# Altium project esp-air-quality-sensor.PrjPcb
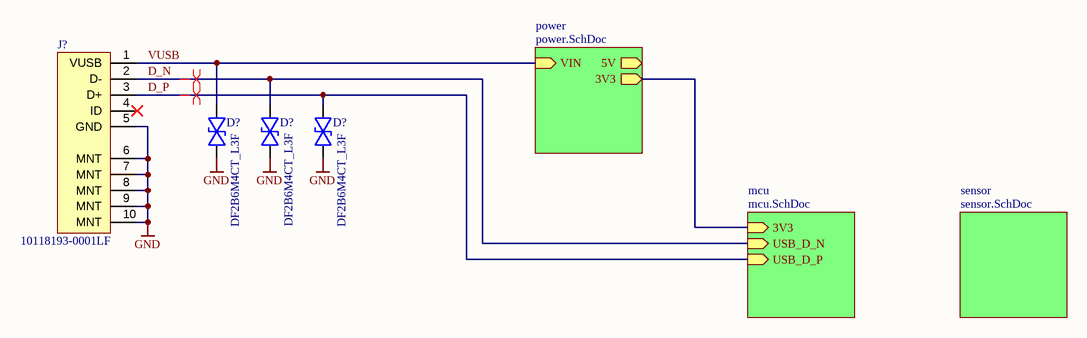
[diagram p0: top.SchDoc]
4 sheets, 59 parts. Net scope: hierarchical (ports join the sheet entries above them; power ports are global).
Board file: board.PcbDoc
Sheets:
  top.SchDoc
    power = power.SchDoc
    mcu = mcu.SchDoc
    sensor = sensor.SchDoc

## Sheet top.SchDoc: schematic template
size 420 x 297 mm; Date: 2021-12-08; Author: Joachim Löfwander; Revision: ABC-123; SheetNumber: 1; SheetTotal: 4; Website: jlofw.com

### Parts
(Parts that share a designator on the sheet are numbered #1, #2 ... from top to bottom, then left to right.)
D?#1  Manufacturer P/N: DF2B6M4CT_L3F  [D_SOD-882]  (hidden comment: Diode_TVS_Bi)
D?#2  Manufacturer P/N: DF2B6M4CT_L3F  [D_SOD-882]  (hidden comment: Diode_TVS_Bi)
D?#3  Manufacturer P/N: DF2B6M4CT_L3F  [D_SOD-882]  (hidden comment: Diode_TVS_Bi)
J?#1  Manufacturer P/N: 10118193-0001LF  [Amphenol_10118193-0001LF_Micro_USB]  (hidden comment: Amphenol_10118193-0001LF_Micro_USB)

### Sub-sheets
mcu = mcu.SchDoc: 3V3 (in), USB_D_P (in), USB_D_N (in)
power = power.SchDoc: VIN (in), 3V3 (out), 5V (out)
sensor = sensor.SchDoc: no entries

### Nets
GND: D?#1.2(A) D?#2.2(A) D?#3.2(A) J?#1.5(GND) J?#1.6(MNT) J?#1.7(MNT) J?#1.8(MNT) J?#1.9(MNT) J?#1.10(MNT)
3V3: sheet power/3V3, sheet mcu/3V3
D_N: D?#2.1(C) J?#1.2(D-) ; sheet mcu/USB_D_N
D_P: D?#3.1(C) J?#1.3(D+) ; sheet mcu/USB_D_P
VUSB: D?#1.1(C) J?#1.1(VUSB) ; sheet power/VIN

Not connected (* = marked no-connect by the designer): J?#1 4(ID)*

### Layout directives
differential pair: D_N, D_P

### Notes on the sheet
- PROJECT
- TITLE
- FILE NAME
- DATE MODIFIED
- SHEET
- REV
- OF
- AUTHOR
- WEBSITE

### Library data of the parts
D?#1-D?#3 = 40005: TVS DIODE 5.5VWM 15VC; Manufacturer: Toshiba; Internal Number: 40005; Package: SOD-882
J?#1 = 110003: Micro USB B SMD Horisontal; Manufacturer: Amphenol ICC / FCI; Internal Number: 110003

## Sheet power.SchDoc: schematic template
size 420 x 297 mm; Date: 2021-12-08; Author: Joachim Löfwander; Revision: ABC-123; SheetNumber: 2; SheetTotal: 4; Website: jlofw.com
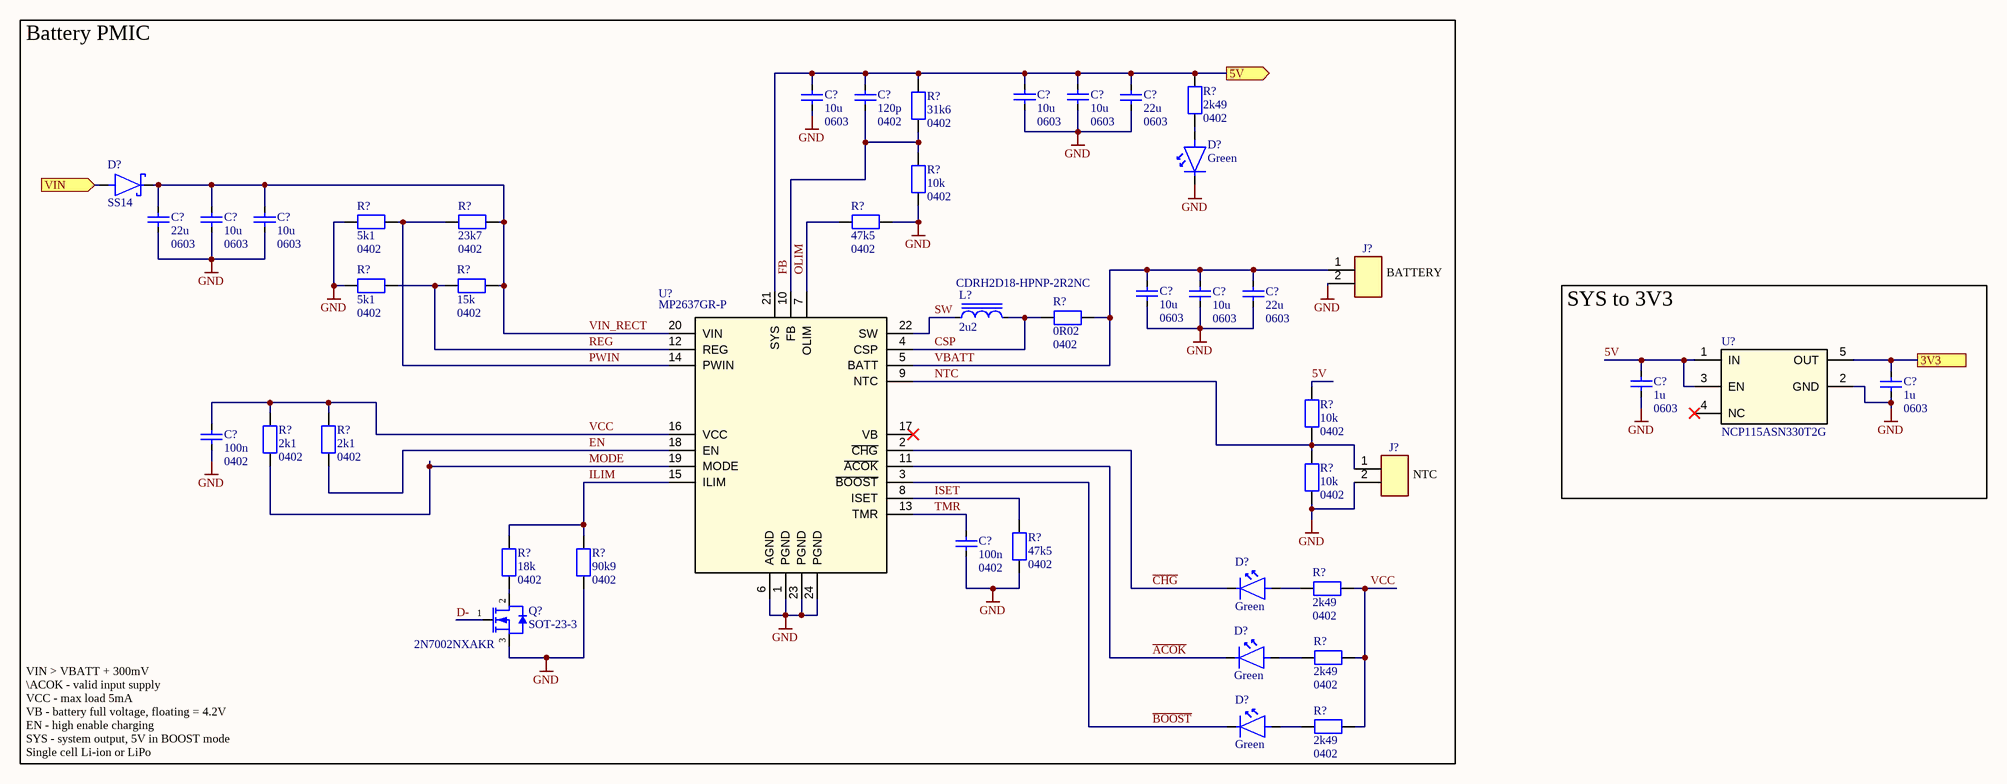
[diagram p1: power.SchDoc]

### Parts
(Parts that share a designator on the sheet are numbered #1, #2 ... from top to bottom, then left to right.)
C?#1  value 10u  Package: 0603  [C_0603_1608Metric_IPCB]  (hidden comment: Capacitor_Ceramic)
C?#2  value 120p  Package: 0402  [C_0402_1005Metric_IPCB]  (hidden comment: Capacitor_Ceramic)
C?#3  value 10u  Package: 0603  [C_0603_1608Metric_IPCB]  (hidden comment: Capacitor_Ceramic)
C?#4  value 10u  Package: 0603  [C_0603_1608Metric_IPCB]  (hidden comment: Capacitor_Ceramic)
C?#5  value 22u  Package: 0603  [C_0603_1608Metric_IPCB]  (hidden comment: Capacitor_Ceramic)
C?#6  value 22u  Package: 0603  [C_0603_1608Metric_IPCB]  (hidden comment: Capacitor_Ceramic)
C?#7  value 10u  Package: 0603  [C_0603_1608Metric_IPCB]  (hidden comment: Capacitor_Ceramic)
C?#8  value 10u  Package: 0603  [C_0603_1608Metric_IPCB]  (hidden comment: Capacitor_Ceramic)
C?#9  value 10u  Package: 0603  [C_0603_1608Metric_IPCB]  (hidden comment: Capacitor_Ceramic)
C?#10  value 10u  Package: 0603  [C_0603_1608Metric_IPCB]  (hidden comment: Capacitor_Ceramic)
C?#11  value 22u  Package: 0603  [C_0603_1608Metric_IPCB]  (hidden comment: Capacitor_Ceramic)
C?#12  value 1u  Package: 0603  [C_0603_1608Metric_IPCB]  (hidden comment: Capacitor_Ceramic)
C?#13  value 1u  Package: 0603  [C_0603_1608Metric_IPCB]  (hidden comment: Capacitor_Ceramic)
C?#14  value 100n  Package: 0402  [C_0402_1005Metric_IPCB]  (hidden comment: Capacitor_Ceramic)
C?#15  value 100n  Package: 0402  [C_0402_1005Metric_IPCB]  (hidden comment: Capacitor_Ceramic)
D?#4  value Green  [LED_0402]  (hidden comment: Diode_LED)
D?#5  Manufacturer P/N: SS14  [D_SMA_IPCB]  (hidden comment: Diode_Schottky)
D?#6  value Green  [LED_0402]  (hidden comment: Diode_LED)
D?#7  value Green  [LED_0402]  (hidden comment: Diode_LED)
D?#8  value Green  [LED_0402]  (hidden comment: Diode_LED)
J?#2  Conn_01x02  [PinHeader_1x02_P2.54mm_Vertical]  (value not drawn)
J?#3  Conn_01x02  [PinHeader_1x02_P2.54mm_Vertical]  (value not drawn)
L?  value 2u2  Manufacturer P/N: CDRH2D18-HPNP-2R2NC  [Sumida_CDRH2D18-HPNP-2R2NC]  (hidden comment: Inductor)
Q?#1  Package: SOT-23-3  Manufacturer P/N: 2N7002NXAKR  [SOT23-3_Standard_IPCB]  (hidden comment: NMOS_GDS)
R?#1  value 2k49  Package: 0402  [R_0402_1005Metric_IPCB]  (hidden comment: Resistor)
R?#2  value 31k6  Package: 0402  [R_0402_1005Metric_IPCB]  (hidden comment: Resistor)
R?#3  value 10k  Package: 0402  [R_0402_1005Metric_IPCB]  (hidden comment: Resistor)
R?#4  value 5k1  Package: 0402  [R_0402_1005Metric_IPCB]  (hidden comment: Resistor)
R?#5  value 23k7  Package: 0402  [R_0402_1005Metric_IPCB]  (hidden comment: Resistor)
R?#6  value 47k5  Package: 0402  [R_0402_1005Metric_IPCB]  (hidden comment: Resistor)
R?#7  value 5k1  Package: 0402  [R_0402_1005Metric_IPCB]  (hidden comment: Resistor)
R?#8  value 15k  Package: 0402  [R_0402_1005Metric_IPCB]  (hidden comment: Resistor)
R?#9  value 0R02  Package: 0402  [R_0402_1005Metric_IPCB]  (hidden comment: Resistor)
R?#10  value 10k  Package: 0402  [R_0402_1005Metric_IPCB]  (hidden comment: Resistor)
R?#11  value 2k1  Package: 0402  [R_0402_1005Metric_IPCB]  (hidden comment: Resistor)
R?#12  value 2k1  Package: 0402  [R_0402_1005Metric_IPCB]  (hidden comment: Resistor)
R?#13  value 10k  Package: 0402  [R_0402_1005Metric_IPCB]  (hidden comment: Resistor)
R?#14  value 47k5  Package: 0402  [R_0402_1005Metric_IPCB]  (hidden comment: Resistor)
R?#15  value 18k  Package: 0402  [R_0402_1005Metric_IPCB]  (hidden comment: Resistor)
R?#16  value 90k9  Package: 0402  [R_0402_1005Metric_IPCB]  (hidden comment: Resistor)
R?#17  value 2k49  Package: 0402  [R_0402_1005Metric_IPCB]  (hidden comment: Resistor)
R?#18  value 2k49  Package: 0402  [R_0402_1005Metric_IPCB]  (hidden comment: Resistor)
R?#19  value 2k49  Package: 0402  [R_0402_1005Metric_IPCB]  (hidden comment: Resistor)
U?#1  NCP115ASN330T2G  [NCP115ASN330T2G]
U?#2  Manufacturer P/N: MP2637GR-P  [MP2637GR]  (hidden comment: MP2637GR)

### Blocks framed on the sheet
Battery PMIC: C?#1-C?#11 C?#14 C?#15 D?#4-D?#8 J?#2 J?#3 L? Q?#1 R?#1-R?#19 U?#2
SYS to 3V3: C?#12 C?#13 U?#1

### Ports
3V3, 5V (out), VIN (in)

### Nets
GND: C?#1.1 C?#3.1 C?#4.1 C?#5.1 C?#6.1 C?#7.1 C?#8.1 C?#9.1 C?#10.1 C?#11.1 C?#12.1 C?#13.1 C?#14.1 C?#15.1 D?#4.1(C) J?#2.2 J?#3.2 Q?#1.3(SOURCE) R?#3.1 R?#4.1 R?#6.2 R?#7.1 R?#13.1 R?#14.1 R?#16.1 U?#1.2(GND) U?#2.1(PGND) U?#2.6(AGND) U?#2.23(PGND) U?#2.24(PGND)
3V3: C?#13.2 U?#1.5(OUT) ; port 3V3
5V: C?#1.2 C?#2.2 C?#3.2 C?#4.2 C?#5.2 R?#1.2 R?#2.2 U?#2.21(SYS) ; port 5V
5V: C?#12.2 R?#10.2 U?#1.1(IN) U?#1.3(EN)  [a separate net that carries the same name]
~{ACOK}: D?#7.1(C) U?#2.11(~{ACOK})
~{BOOST}: D?#8.1(C) U?#2.3(~{BOOST})
~{CHG}: D?#6.1(C) U?#2.2(~{CHG})
CSP: L?.2 R?#9.1 U?#2.4(CSP)
D-: Q?#1.1(GATE)
EN: R?#12.1 U?#2.18(EN)
FB: C?#2.1 R?#2.1 R?#3.2 U?#2.10(FB)
ILIM: R?#15.2 R?#16.2 U?#2.15(ILIM)
ISET: R?#14.2 U?#2.8(ISET)
MODE: R?#11.1 U?#2.19(MODE)
NTC: J?#3.1 R?#10.1 R?#13.2 U?#2.9(NTC)
OLIM: R?#6.1 U?#2.7(OLIM)
PWIN: R?#4.2 R?#5.1 U?#2.14(PWIN)
REG: R?#7.2 R?#8.1 U?#2.12(REG)
SW: L?.1 U?#2.22(SW)
TMR: C?#15.2 U?#2.13(TMR)
VBATT: C?#9.2 C?#10.2 C?#11.2 J?#2.1 R?#9.2 U?#2.5(BATT)
VCC: C?#14.2 R?#11.2 R?#12.2 R?#17.2 R?#18.2 R?#19.2 U?#2.16(VCC)
VIN_RECT: C?#6.2 C?#7.2 C?#8.2 D?#5.1(C) R?#5.2 R?#8.2 U?#2.20(VIN)
VUSB: D?#5.2(A) ; port VIN
NetD?#4_2: D?#4.2(A) R?#1.1
NetD?#6_2: D?#6.2(A) R?#17.1
NetD?#7_2: D?#7.2(A) R?#18.1
NetD?#8_2: D?#8.2(A) R?#19.1
NetQ?#1_2: Q?#1.2(DRAIN) R?#15.1

Not connected (* = marked no-connect by the designer): U?#1 4(NC)*; U?#2 17(VB)*

### Notes on the sheet
- (near J?#2) BATTERY
- (near J?#3) NTC
- VIN > VBATT + 300mV
  \ACOK - valid input supply
  VCC - max load 5mA
  VB - battery full voltage, floating = 4.2V
  EN - high enable charging
  SYS - system output, 5V in BOOST mode
  Single cell Li-ion or LiPo
- PROJECT
- TITLE
- FILE NAME
- DATE MODIFIED
- SHEET
- REV
- OF
- AUTHOR
- WEBSITE

### Library data of the parts
C?#1 C?#3 C?#4 C?#7-C?#10 = 20014: 16V 10u 0603 X5R; Internal Number: 20014
C?#2 = 20015: 50V 120p 0402 X7R; Internal Number: 20015
C?#5 C?#6 C?#11 = 20013: 16V 22u 0603 X5R; Internal Number: 20013
C?#12 C?#13 = 20016: 16V 1u 0603 X7R; Internal Number: 20016
C?#14 C?#15 = 20002: 50V 100n 0402 X7R; Internal Number: 20002
D?#4 D?#6-D?#8 = 40002: LED 0402 Green; Internal Number: 40002; Package: 0402
D?#5 = 40006: Schottky 40 V 1A SMA; Manufacturer: onsemi; Internal Number: 40006; Package: SMA
J?#2 J?#3 = 110001: 01x02 P2.54 PinHeader; Internal Number: 110001
L? = 190001: Inductor 2.2uH 1.6A 60mOhm; Manufacturer: Sumida; Internal Number: 190001
Q?#1 = 60001: 60V 300mA NMOS SOT-23-3; Manufacturer: Nexperia; Internal Number: 60001
R?#1 R?#17-R?#19 = 10021: 0402 2k49 1%; Internal Number: 10021
R?#2 = 10023: 0402 31k6 1%; Internal Number: 10023
R?#3 R?#10 R?#13 = 10033: 0402 10k 1%; Internal Number: 10033
R?#4 R?#7 = 10029: 0402 5k1 1%; Internal Number: 10029
R?#5 = 10017: 0402 23k7 1%; Internal Number: 10017
R?#6 R?#14 = 10034: 0402 47k5 1%; Internal Number: 10034
R?#8 = 10006: 0402 15k 1%; Internal Number: 10006
R?#9 = 10001: 0402 0R02 1%; Internal Number: 10001
R?#11 R?#12 = 10019: 0402 2k1 1%; Internal Number: 10019
R?#15 = 10008: 0402 18k 1%; Internal Number: 10008
R?#16 = 10032: 0402 90k9 1%; Internal Number: 10032
U?#1 = 80001: 3V3 LDO 300mA; Manufacturer: onsemi; Internal Number: 80001; Manufacturer P/N: NCP115ASN330T2G; Package: TSOP5
U?#2 = 180003: MP2637GR Li-ion charger; Manufacturer: Monolithic Power Systems; Internal Number: 180003; Package: QFN

## Sheet mcu.SchDoc: schematic template
size 420 x 297 mm; Date: 2021-12-08; Author: Joachim Löfwander; Revision: ABC-123; SheetNumber: 3; SheetTotal: 4; Website: jlofw.com
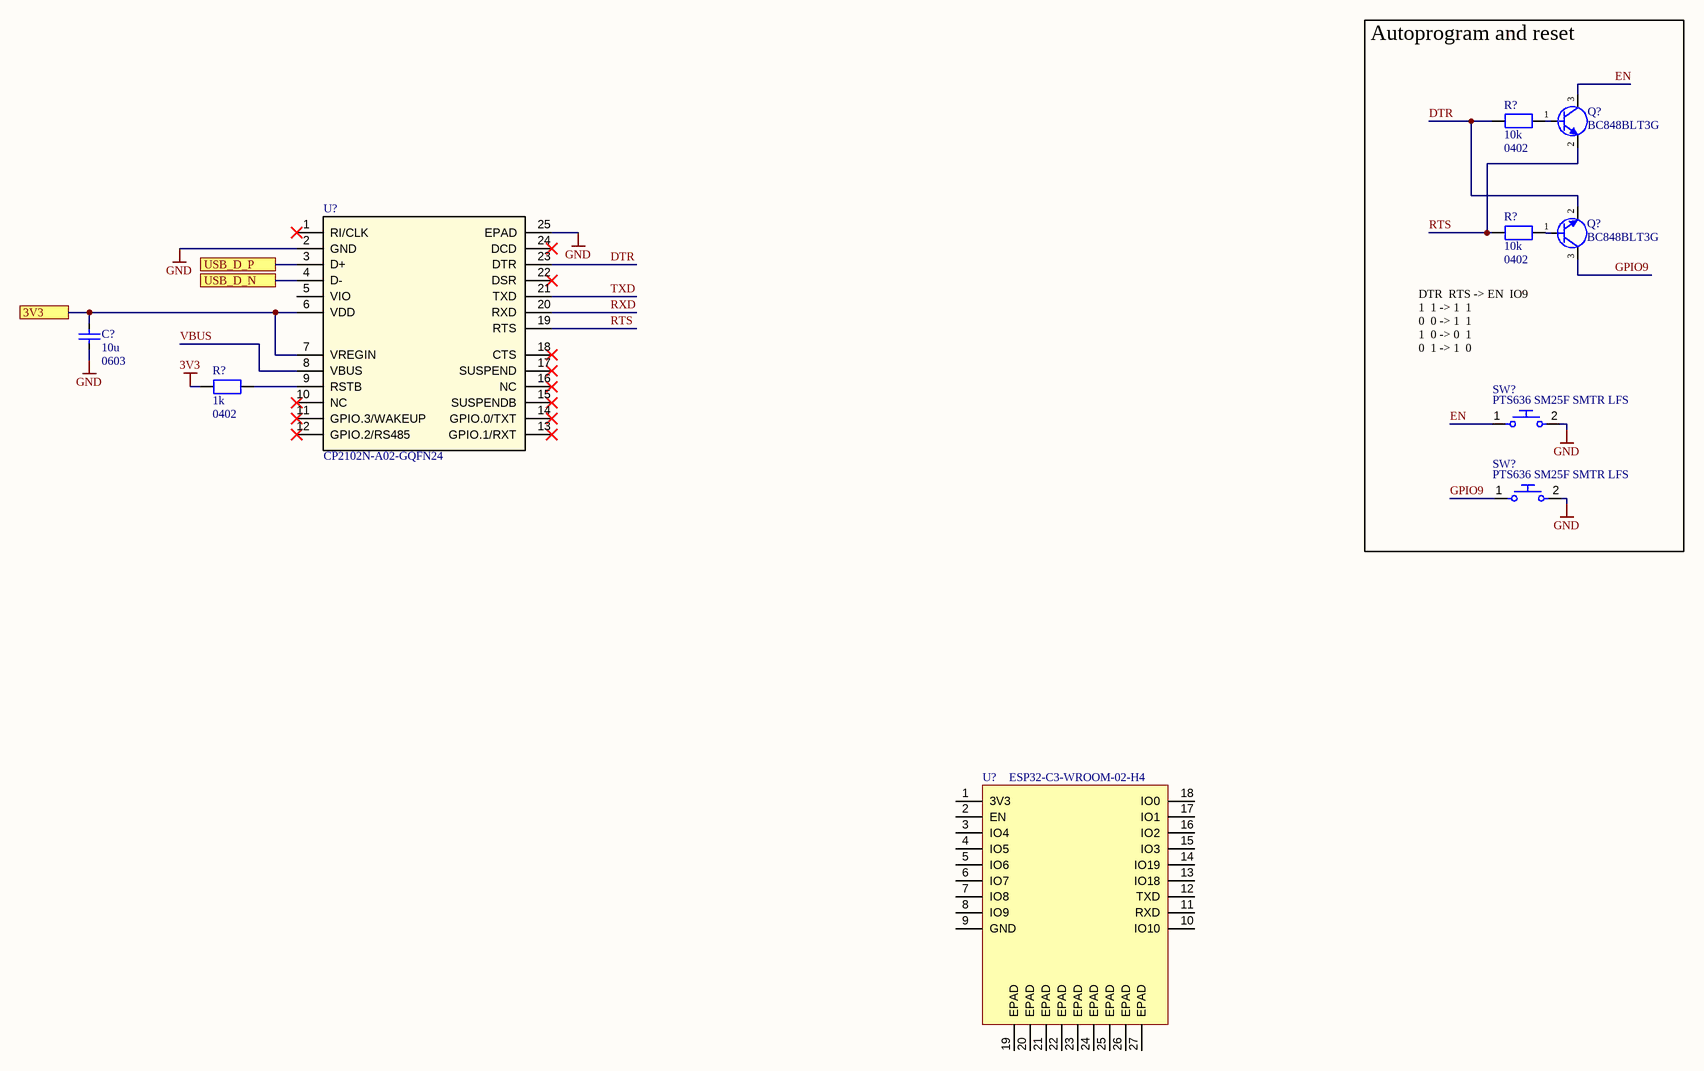
[diagram p2: mcu.SchDoc]

### Parts
(Parts that share a designator on the sheet are numbered #1, #2 ... from top to bottom, then left to right.)
C?#16  value 10u  Package: 0603  [C_0603_1608Metric_IPCB]  (hidden comment: Capacitor_Ceramic)
Q?#2  Manufacturer P/N: BC848BLT3G  [SOT23-3_Standard_IPCB]  (hidden comment: BJT_NPN_BEC)
Q?#3  Manufacturer P/N: BC848BLT3G  [SOT23-3_Standard_IPCB]  (hidden comment: BJT_NPN_BEC)
R?#20  value 10k  Package: 0402  [R_0402_1005Metric_IPCB]  (hidden comment: Resistor)
R?#21  value 10k  Package: 0402  [R_0402_1005Metric_IPCB]  (hidden comment: Resistor)
R?#22  value 1k  Package: 0402  [R_0402_1005Metric_IPCB]  (hidden comment: Resistor)
SW?#1  Manufacturer P/N: PTS636 SM25F SMTR LFS  [Pushbutton_PTS636_SM25F_SMTR_LFS]  (hidden comment: SW_Single_NO_BridgingPads)
SW?#2  Manufacturer P/N: PTS636 SM25F SMTR LFS  [Pushbutton_PTS636_SM25F_SMTR_LFS]  (hidden comment: SW_Single_NO_BridgingPads)
U?#3  Manufacturer P/N: CP2102N-A02-GQFN24  [CP2102N_QFN24]  (hidden comment: CP2102N_QFN24)
U?#4  ESP32-C3-WROOM-02-H4  [ESP32-C3-WROOM-02-H4]

### Blocks framed on the sheet
Autoprogram and reset: Q?#2 Q?#3 R?#20 R?#21 SW?#1 SW?#2

### Ports
3V3, USB_D_N, USB_D_P

### Nets
3V3: R?#22.1
GND: C?#16.1 SW?#1.2 SW?#2.2 U?#3.2(GND) U?#3.25(EPAD)
3V3: C?#16.2 U?#3.6(VDD) U?#3.7(VREGIN) ; port 3V3  [a separate net that carries the same name]
D_N: U?#3.4(D-) ; port USB_D_N
D_P: U?#3.3(D+) ; port USB_D_P
DTR: Q?#3.2(E) R?#20.1 U?#3.23(DTR)
EN: Q?#2.3(C) SW?#1.1
GPIO9: Q?#3.3(C) SW?#2.1
RTS: Q?#2.2(E) R?#21.1 U?#3.19(RTS)
RXD: U?#3.20(RXD)
TXD: U?#3.21(TXD)
VBUS: U?#3.8(VBUS)
NetQ?#2_1: Q?#2.1(B) R?#20.2
NetQ?#3_1: Q?#3.1(B) R?#21.2
NetR?#22_2: R?#22.2 U?#3.9(RSTB)

Not connected (* = marked no-connect by the designer): U?#3 1(RI/CLK)* 5(VIO) 10(NC)* 11(GPIO.3/WAKEUP)* 12(GPIO.2/RS485)* 13(GPIO.1/RXT)* 14(GPIO.0/TXT)* 15(SUSPENDB)* 16(NC)* 17(SUSPEND)* 18(CTS)* 22(DSR)* 24(DCD)*; U?#4 1(3V3) 2(EN) 3(IO4) 4(IO5) 5(IO6) 6(IO7) 7(IO8) 8(IO9) 9(GND) 10(IO10) 11(RXD) 12(TXD) 13(IO18) 14(IO19) 15(IO3) 16(IO2) 17(IO1) 18(IO0) 19(EPAD) 20(EPAD) 21(EPAD) 22(EPAD) 23(EPAD) 24(EPAD) 25(EPAD) 26(EPAD) 27(EPAD)

### Notes on the sheet
- DTR  RTS -> EN  IO9
  1  1 -> 1  1
  0  0 -> 1  1
  1  0 -> 0  1
  0  1 -> 1  0
- PROJECT
- TITLE
- FILE NAME
- DATE MODIFIED
- SHEET
- REV
- OF
- AUTHOR
- WEBSITE

### Library data of the parts
C?#16 = 20014: 16V 10u 0603 X5R; Internal Number: 20014
Q?#2 Q?#3 = 50001: TRANS NPN 30V 100MA SOT23-3; Manufacturer: onsemi; Internal Number: 50001; Package: SOT23-3
R?#20 R?#21 = 10033: 0402 10k 1%; Internal Number: 10033
R?#22 = 10009: 0402 1k 1%; Internal Number: 10009
SW?#1 SW?#2 = 100001: Manufacturer: C&K; Internal Number: 100001
U?#3 = 90002: USB to UART; Manufacturer: Silicon Labs; Internal Number: 90002; Package: QFN24
U?#4 = 130001: ESP32 C3 SoC; Internal Number: 130001; Package: SoC

## Sheet sensor.SchDoc
size A4; SheetNumber: 4; SheetTotal: 4

## Nets that join several sheets
GND: top (9 pins), power (30 pins), mcu (5 pins)
3V3: power (C?#13.2 U?#1.5), mcu (C?#16.2 U?#3.6 U?#3.7)
D_N: top (D?#2.1 J?#1.2), mcu (U?#3.4)
D_P: top (D?#3.1 J?#1.3), mcu (U?#3.3)
VUSB: top (D?#1.1 J?#1.1), power (D?#5.2)